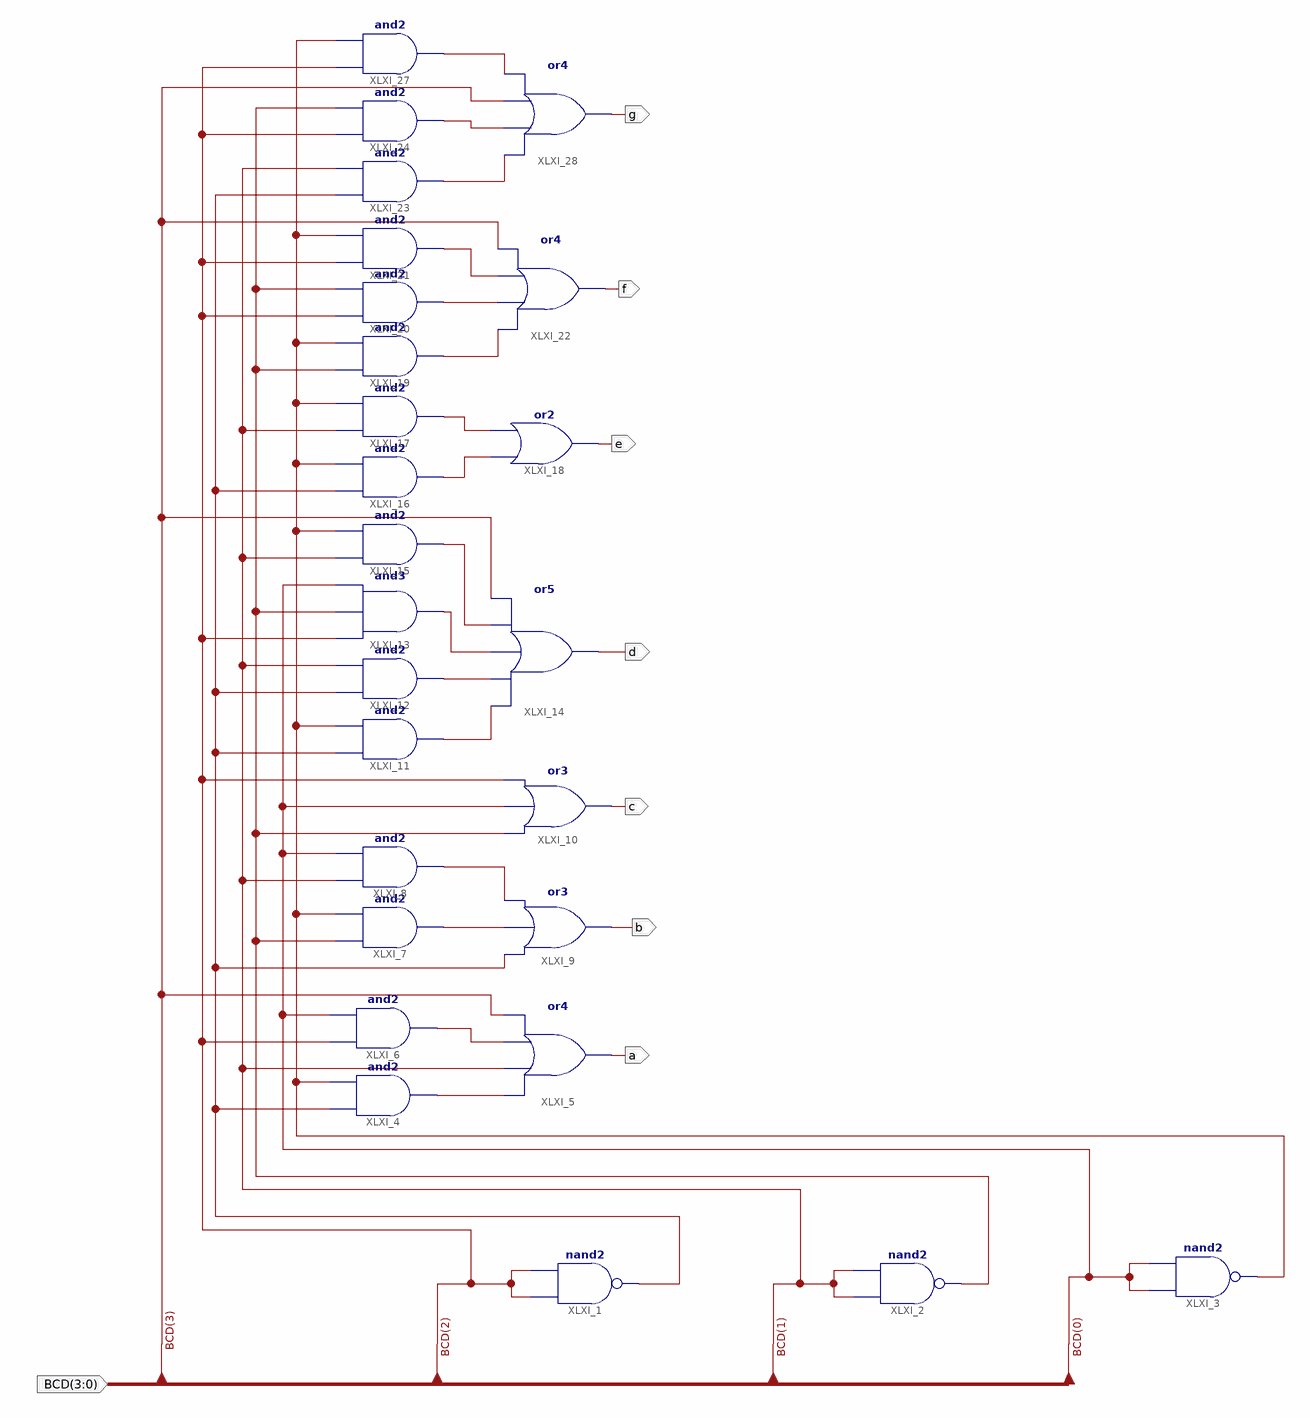
[diagram p0: schematic sheet 1]
// Xilinx ISE schematic decodernn.sch (spartan6) as structural Verilog: 26 symbols, 8 ports
module decodernn (
  input  [3:0] BCD,
  output a,
  output b,
  output c,
  output d,
  output e,
  output f,
  output g
);

  wire XLXN_6, XLXN_9, XLXN_10, XLXN_11, XLXN_14, XLXN_15, XLXN_16, XLXN_19, XLXN_20, XLXN_34, XLXN_37,
       XLXN_40, XLXN_41, XLXN_44, XLXN_45, XLXN_46, XLXN_48, XLXN_49, XLXN_50;

  nand XLXI_1 (XLXN_16, BCD[2], BCD[2]);
  nand XLXI_2 (XLXN_6, BCD[1], BCD[1]);
  nand XLXI_3 (XLXN_9, BCD[0], BCD[0]);
  and XLXI_4 (XLXN_10, XLXN_16, XLXN_9);
  or XLXI_5 (a, XLXN_10, BCD[1], XLXN_11, BCD[3]);
  and XLXI_6 (XLXN_11, BCD[2], BCD[0]);
  and XLXI_7 (XLXN_15, XLXN_6, XLXN_9);
  and XLXI_8 (XLXN_14, BCD[1], BCD[0]);
  or XLXI_9 (b, XLXN_16, XLXN_15, XLXN_14);
  or XLXI_10 (c, XLXN_6, BCD[0], BCD[2]);
  and XLXI_11 (XLXN_19, XLXN_16, XLXN_9);
  and XLXI_12 (XLXN_20, XLXN_16, BCD[1]);
  and XLXI_13 (XLXN_34, BCD[2], XLXN_6, BCD[0]);
  or XLXI_14 (d, XLXN_19, XLXN_20, XLXN_34, XLXN_37, BCD[3]);
  and XLXI_15 (XLXN_37, BCD[1], XLXN_9);
  and XLXI_16 (XLXN_41, XLXN_16, XLXN_9);
  and XLXI_17 (XLXN_40, BCD[1], XLXN_9);
  or XLXI_18 (e, XLXN_41, XLXN_40);
  and XLXI_19 (XLXN_44, XLXN_6, XLXN_9);
  and XLXI_20 (XLXN_45, BCD[2], XLXN_6);
  and XLXI_21 (XLXN_46, BCD[2], XLXN_9);
  or XLXI_22 (f, XLXN_44, XLXN_45, XLXN_46, BCD[3]);
  and XLXI_23 (XLXN_50, XLXN_16, BCD[1]);
  and XLXI_24 (XLXN_49, BCD[2], XLXN_6);
  and XLXI_27 (XLXN_48, BCD[2], XLXN_9);
  or XLXI_28 (g, XLXN_50, XLXN_49, BCD[3], XLXN_48);
endmodule
